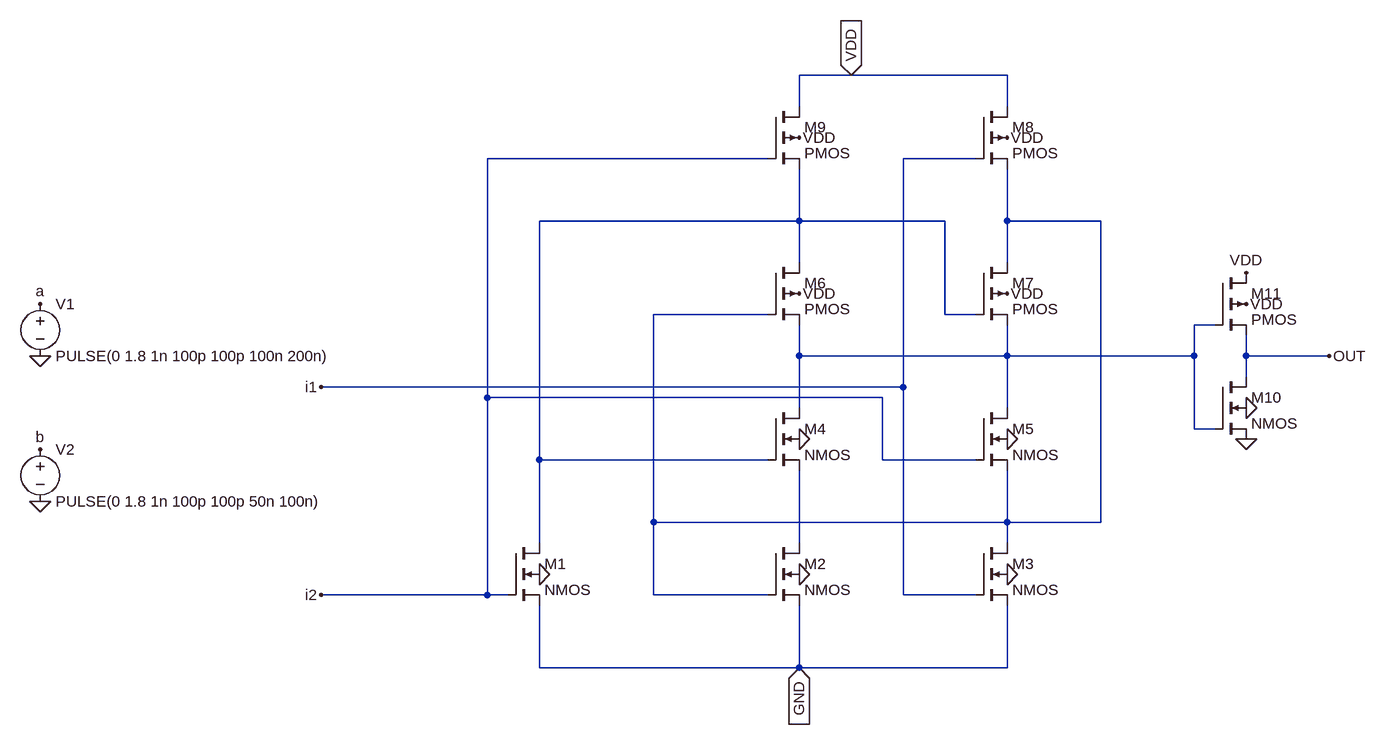
[diagram p0: schematic exnor.asc]
exnor.asc, the LTspice schematic file:
Version 4
SHEET 1 1412 680
WIRE 528 -624 448 -624
WIRE 768 -624 528 -624
WIRE 448 -576 448 -624
WIRE 768 -576 768 -624
WIRE 400 -496 -32 -496
WIRE 720 -496 608 -496
WIRE 448 -400 448 -480
WIRE 448 -400 48 -400
WIRE 672 -400 448 -400
WIRE 768 -400 768 -480
WIRE 912 -400 768 -400
WIRE 448 -336 448 -400
WIRE 768 -336 768 -400
WIRE 400 -256 224 -256
WIRE 672 -256 672 -400
WIRE 720 -256 672 -256
WIRE 1088 -240 1056 -240
WIRE 448 -192 448 -240
WIRE 768 -192 768 -240
WIRE 768 -192 448 -192
WIRE 1056 -192 1056 -240
WIRE 1056 -192 768 -192
WIRE 1136 -192 1136 -224
WIRE 1264 -192 1136 -192
WIRE 1136 -160 1136 -192
WIRE 608 -144 608 -496
WIRE 608 -144 -288 -144
WIRE -32 -128 -32 -496
WIRE 576 -128 -32 -128
WIRE 448 -112 448 -192
WIRE 768 -112 768 -192
WIRE 1056 -80 1056 -192
WIRE 1088 -80 1056 -80
WIRE 48 -32 48 -400
WIRE 400 -32 48 -32
WIRE 576 -32 576 -128
WIRE 720 -32 576 -32
WIRE 224 64 224 -256
WIRE 768 64 768 -16
WIRE 768 64 224 64
WIRE 912 64 912 -400
WIRE 912 64 768 64
WIRE 48 96 48 -32
WIRE 448 96 448 -16
WIRE 768 96 768 64
WIRE -32 176 -32 -128
WIRE -32 176 -288 176
WIRE 0 176 -32 176
WIRE 224 176 224 64
WIRE 400 176 224 176
WIRE 608 176 608 -144
WIRE 720 176 608 176
WIRE 48 288 48 192
WIRE 448 288 448 192
WIRE 448 288 48 288
WIRE 768 288 768 192
WIRE 768 288 448 288
FLAG -720 -272 a
FLAG -720 -48 b
FLAG -288 -144 i1
FLAG -288 176 i2
FLAG -720 -192 0
FLAG -720 32 0
FLAG 48 144 0
FLAG 448 144 0
FLAG 768 144 0
FLAG 768 -64 0
FLAG 448 -64 0
FLAG 448 -288 VDD
FLAG 448 -528 VDD
FLAG 768 -528 VDD
FLAG 768 -288 VDD
FLAG 1136 -112 0
FLAG 1136 -64 0
FLAG 1136 -320 VDD
FLAG 1136 -272 VDD
FLAG 1264 -192 OUT
FLAG 448 288 GND
IOPIN 448 288 In
FLAG 528 -624 VDD
IOPIN 528 -624 In
SYMBOL voltage -720 -288 R0
SYMATTR InstName V1
SYMATTR Value PULSE(0 1.8 1n 100p 100p 100n 200n)
SYMBOL voltage -720 -64 R0
WINDOW 123 0 0 Left 0
WINDOW 39 0 0 Left 0
SYMATTR InstName V2
SYMATTR Value PULSE(0 1.8 1n 100p 100p 50n 100n)
SYMBOL nmos4 0 96 R0
SYMATTR InstName M1
SYMBOL nmos4 400 96 R0
SYMATTR InstName M2
SYMBOL nmos4 720 96 R0
SYMATTR InstName M3
SYMBOL nmos4 400 -112 R0
SYMATTR InstName M4
SYMBOL nmos4 720 -112 R0
SYMATTR InstName M5
SYMBOL pmos4 400 -336 R0
SYMATTR InstName M6
SYMBOL pmos4 720 -336 R0
SYMATTR InstName M7
SYMBOL pmos4 720 -576 R0
SYMATTR InstName M8
SYMBOL pmos4 400 -576 R0
SYMATTR InstName M9
SYMBOL nmos4 1088 -160 R0
SYMATTR InstName M10
SYMBOL pmos4 1088 -320 R0
SYMATTR InstName M11

The netlist it stands for:
* exnor.asc
V1 a 0 PULSE(0 1.8 1n 100p 100p 100n 200n)
V2 b 0 PULSE(0 1.8 1n 100p 100p 50n 100n)
M1 N001 i2 GND 0 NMOS
M2 N004 N002 GND 0 NMOS
M3 N002 i1 GND 0 NMOS
M4 N003 N001 N004 0 NMOS
M5 N003 i2 N002 0 NMOS
M6 N001 N002 N003 VDD PMOS
M7 N002 N001 N003 VDD PMOS
M8 VDD i1 N002 VDD PMOS
M9 VDD i2 N001 VDD PMOS
M10 OUT N003 0 0 NMOS
M11 VDD N003 OUT VDD PMOS
.model NMOS NMOS
.model PMOS PMOS
.lib standard.mos
.backanno
.end